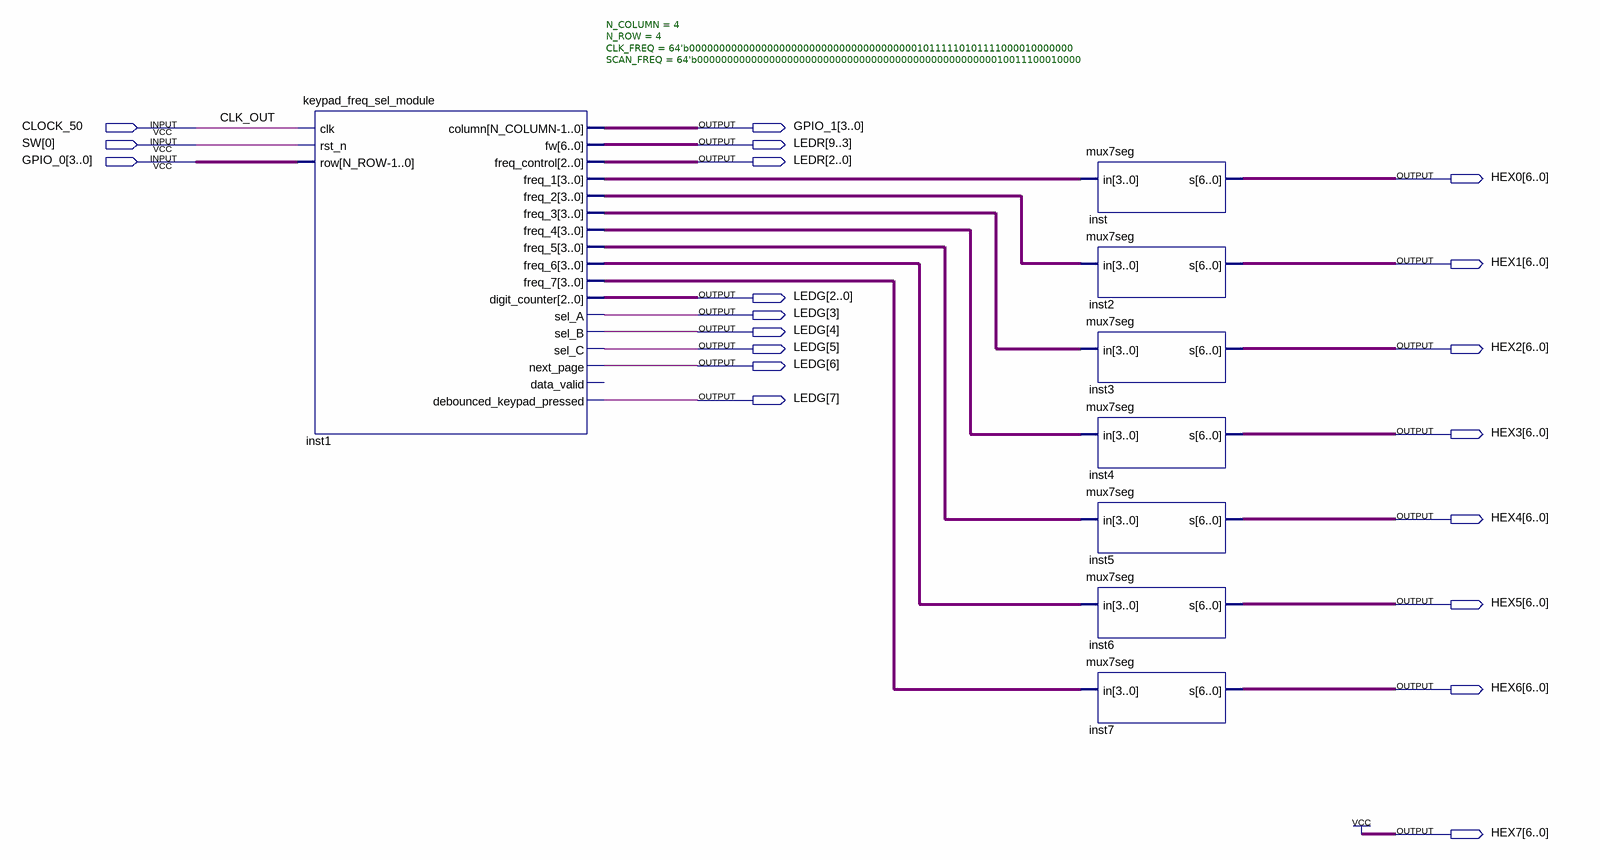
[diagram p0: schematic sheet]
// Quartus schematic keypad_freq_sel.bdf as structural Verilog: 8 symbols, 20 pins
module keypad_freq_sel (
  input  CLOCK_50,
  input  [0:0] SW,
  input  [3:0] GPIO_0,
  output [3:0] GPIO_1,
  output [9:0] LEDR,
  output [6:0] HEX0,
  output [6:0] HEX1,
  output [7:0] LEDG,
  output [6:0] HEX2,
  output [6:0] HEX3,
  output [6:0] HEX4,
  output [6:0] HEX5,
  output [6:0] HEX6,
  output [6:0] HEX7
);

  wire [3:0] inst1_freq_1, inst1_freq_2, inst1_freq_3, inst1_freq_4, inst1_freq_5, inst1_freq_6, inst1_freq_7;

  keypad_freq_sel_module #(.N_COLUMN(4), .N_ROW(4), .CLK_FREQ(64'b0000000000000000000000000000000000000010111110101111000010000000), .SCAN_FREQ(64'b0000000000000000000000000000000000000000000000000010011100010000)) inst1 (
    .clk(CLOCK_50), .rst_n(SW[0]), .row(GPIO_0), .column(GPIO_1), .fw(LEDR[9:3]), .freq_control(LEDR[2:0]),
    .freq_1(inst1_freq_1), .freq_2(inst1_freq_2), .freq_3(inst1_freq_3), .freq_4(inst1_freq_4),
    .freq_5(inst1_freq_5), .freq_6(inst1_freq_6), .freq_7(inst1_freq_7), .digit_counter(LEDG[2:0]),
    .sel_A(LEDG[3]), .sel_B(LEDG[4]), .sel_C(LEDG[5]), .next_page(LEDG[6]), .debounced_keypad_pressed(LEDG[7]));  // open: data_valid
  mux7seg inst (.in(inst1_freq_1), .s(HEX0));
  mux7seg inst2 (.in(inst1_freq_2), .s(HEX1));
  mux7seg inst3 (.in(inst1_freq_3), .s(HEX2));
  mux7seg inst4 (.in(inst1_freq_4), .s(HEX3));
  mux7seg inst5 (.in(inst1_freq_5), .s(HEX4));
  mux7seg inst6 (.in(inst1_freq_6), .s(HEX5));
  mux7seg inst7 (.in(inst1_freq_7), .s(HEX6));

  assign HEX7 = {7{1'b1}};

  // Other names for the same wires on the sheet: CLK_OUT = CLOCK_50
endmodule
